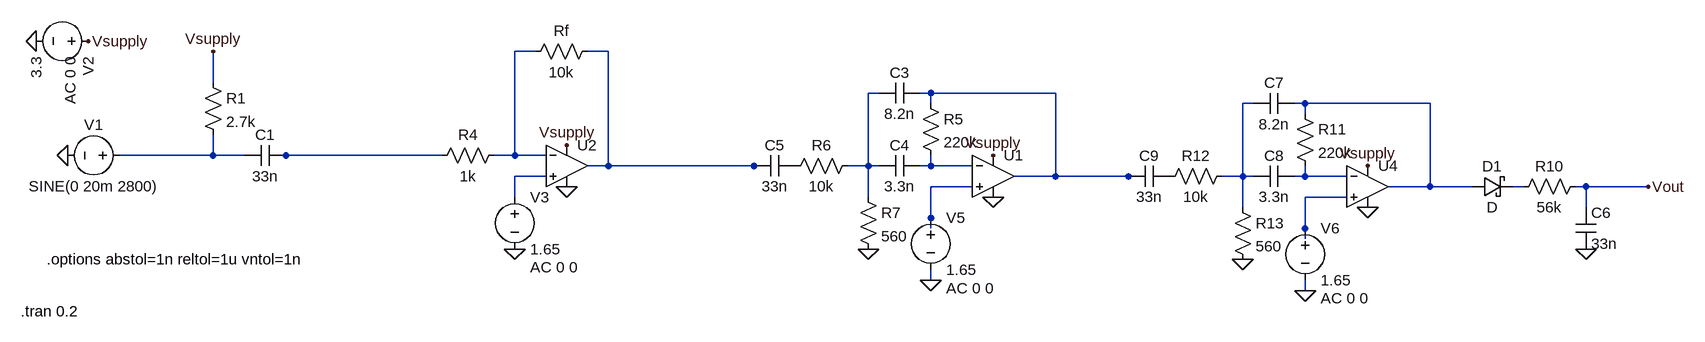
[diagram p0: schematic FullSim_connected.asc]
FullSim_connected.asc, the LTspice schematic file:
Version 4
SHEET 1 4980 740
WIRE 672 0 640 0
WIRE 784 0 752 0
WIRE 176 48 176 0
WIRE 1200 64 1184 64
WIRE 1280 64 1264 64
WIRE 1472 64 1280 64
WIRE 1280 80 1280 64
WIRE 1776 80 1760 80
WIRE 1856 80 1840 80
WIRE 2048 80 1856 80
WIRE 1856 96 1856 80
WIRE 176 160 176 128
WIRE 176 160 32 160
WIRE 224 160 176 160
WIRE 288 160 272 160
WIRE 528 160 288 160
WIRE 640 160 640 0
WIRE 640 160 608 160
WIRE 688 160 640 160
WIRE 784 176 784 0
WIRE 784 176 752 176
WIRE 1008 176 784 176
WIRE 1024 176 1008 176
WIRE 1184 176 1184 64
WIRE 1184 176 1152 176
WIRE 1200 176 1184 176
WIRE 1280 176 1280 160
WIRE 1280 176 1264 176
WIRE 1344 176 1280 176
WIRE 688 192 640 192
WIRE 1472 192 1472 64
WIRE 1472 192 1408 192
WIRE 1584 192 1472 192
WIRE 1600 192 1584 192
WIRE 1760 192 1760 80
WIRE 1760 192 1728 192
WIRE 1776 192 1760 192
WIRE 1856 192 1856 176
WIRE 1856 192 1840 192
WIRE 1920 192 1856 192
WIRE 1344 208 1280 208
WIRE 2048 208 2048 80
WIRE 2048 208 1984 208
WIRE 2112 208 2048 208
WIRE 2192 208 2176 208
WIRE 2288 208 2272 208
WIRE 2384 208 2288 208
WIRE 640 224 640 192
WIRE 1184 224 1184 176
WIRE 1920 224 1856 224
WIRE 1760 240 1760 192
WIRE 2288 240 2288 208
WIRE 1280 256 1280 208
WIRE 1280 272 1280 256
WIRE 1856 272 1856 224
WIRE 1856 288 1856 272
WIRE 1280 352 1280 336
WIRE 1856 368 1856 352
FLAG -96 -16 0
FLAG -16 -16 Vsupply
FLAG -48 160 0
FLAG 176 0 Vsupply
FLAG 720 208 0
FLAG 720 144 Vsupply
FLAG 1184 304 0
FLAG 1376 224 0
FLAG 1376 160 Vsupply
FLAG 640 304 0
FLAG 1280 352 0
FLAG 1760 320 0
FLAG 1952 240 0
FLAG 1952 176 Vsupply
FLAG 1856 368 0
FLAG 2288 304 0
FLAG 2384 208 Vout
SYMBOL voltage 48 160 R90
WINDOW 0 -32 56 VBottom 2
WINDOW 3 32 56 VTop 2
WINDOW 123 0 0 Left 0
WINDOW 39 0 0 Left 0
SYMATTR InstName V1
SYMATTR Value SINE(0 20m 2800)
SYMBOL voltage 0 -16 R90
WINDOW 123 24 44 Left 2
WINDOW 39 0 0 Left 0
SYMATTR Value2 AC 0 0
SYMATTR InstName V2
SYMATTR Value 3.3
SYMBOL cap 288 144 R90
WINDOW 0 0 32 VBottom 2
WINDOW 3 32 32 VTop 2
SYMATTR InstName C1
SYMATTR Value 33n
SYMBOL res 160 32 R0
SYMATTR InstName R1
SYMATTR Value 2.7k
SYMBOL res 624 144 R90
WINDOW 0 0 56 VBottom 2
WINDOW 3 32 56 VTop 2
SYMATTR InstName R4
SYMATTR Value 1k
SYMBOL OpAmps\\UniversalOpAmp2 720 176 R0
SYMATTR InstName U2
SYMATTR Value2 ""
SYMATTR SpiceLine Aol=100k GBW=10Meg Slew=5.5Meg Vos=0.5m
SYMATTR SpiceLine2 Rin=1Meg Rout=75
SYMBOL res 768 -16 R90
WINDOW 0 0 56 VBottom 2
WINDOW 3 32 56 VTop 2
SYMATTR InstName Rf
SYMATTR Value 10k
SYMBOL cap 1264 48 R90
WINDOW 0 0 32 VBottom 2
WINDOW 3 32 32 VTop 2
SYMATTR InstName C3
SYMATTR Value 8.2n
SYMBOL cap 1264 160 R90
WINDOW 0 0 32 VBottom 2
WINDOW 3 32 32 VTop 2
SYMATTR InstName C4
SYMATTR Value 3.3n
SYMBOL res 1264 64 R0
SYMATTR InstName R5
SYMATTR Value 220k
SYMBOL res 1168 160 R90
WINDOW 0 0 56 VBottom 2
WINDOW 3 32 56 VTop 2
SYMATTR InstName R6
SYMATTR Value 10k
SYMBOL res 1168 208 R0
SYMATTR InstName R7
SYMATTR Value 560
SYMBOL cap 1072 160 R90
WINDOW 0 0 32 VBottom 2
WINDOW 3 32 32 VTop 2
SYMATTR InstName C5
SYMATTR Value 33n
SYMBOL voltage 640 208 R0
WINDOW 123 24 124 Left 2
WINDOW 39 0 0 Left 0
SYMATTR Value2 AC 0 0
SYMATTR InstName V3
SYMATTR Value 1.65
SYMBOL voltage 1280 240 R0
WINDOW 123 24 124 Left 2
WINDOW 39 0 0 Left 0
SYMATTR Value2 AC 0 0
SYMATTR InstName V5
SYMATTR Value 1.65
SYMBOL schottky 2112 224 R270
WINDOW 0 32 32 VTop 2
WINDOW 3 0 32 VBottom 2
SYMATTR InstName D1
SYMBOL cap 2272 304 M180
WINDOW 0 24 56 Left 2
WINDOW 3 24 8 Left 2
SYMATTR InstName C6
SYMATTR Value 33n
SYMBOL res 2288 192 R90
WINDOW 0 0 56 VBottom 2
WINDOW 3 32 56 VTop 2
SYMATTR InstName R10
SYMATTR Value 56k
SYMBOL cap 1840 64 R90
WINDOW 0 0 32 VBottom 2
WINDOW 3 32 32 VTop 2
SYMATTR InstName C7
SYMATTR Value 8.2n
SYMBOL cap 1840 176 R90
WINDOW 0 0 32 VBottom 2
WINDOW 3 32 32 VTop 2
SYMATTR InstName C8
SYMATTR Value 3.3n
SYMBOL res 1840 80 R0
SYMATTR InstName R11
SYMATTR Value 220k
SYMBOL res 1744 176 R90
WINDOW 0 0 56 VBottom 2
WINDOW 3 32 56 VTop 2
SYMATTR InstName R12
SYMATTR Value 10k
SYMBOL res 1744 224 R0
SYMATTR InstName R13
SYMATTR Value 560
SYMBOL cap 1648 176 R90
WINDOW 0 0 32 VBottom 2
WINDOW 3 32 32 VTop 2
SYMATTR InstName C9
SYMATTR Value 33n
SYMBOL voltage 1856 256 R0
WINDOW 123 24 124 Left 2
WINDOW 39 0 0 Left 0
SYMATTR Value2 AC 0 0
SYMATTR InstName V6
SYMATTR Value 1.65
SYMBOL OpAmps\\UniversalOpAmp2 1376 192 R0
SYMATTR InstName U1
SYMATTR Value2 ""
SYMATTR SpiceLine Aol=100k GBW=10Meg Slew=5.5Meg Vos=0.5m
SYMATTR SpiceLine2 Rin=1Meg Rout=75
SYMBOL OpAmps\\UniversalOpAmp2 1952 208 R0
SYMATTR InstName U4
SYMATTR Value2 ""
SYMATTR SpiceLine Aol=100k GBW=10Meg Slew=5.5Meg Vos=0.5m
SYMATTR SpiceLine2 Rin=1Meg Rout=75
TEXT -80 320 Left 2 !.options abstol=1n reltol=1u vntol=1n
TEXT -120 400 Left 2 !.tran 0.2

The netlist it stands for:
* FullSim_connected.asc
V1 N007 0 SINE(0 20m 2800)
V2 Vsupply 0 3.3 AC 0 0
C1 N008 N007 33n
R1 Vsupply N007 2.7k
R4 N001 N008 1k
XU2 N010 N001 Vsupply 0 N002 level2 Aol=100k GBW=10Meg Slew=5.5Meg Vos=0.5m Rin=1Meg Rout=75  ; pins In+ In- V+ V- OUT
Rf N002 N001 10k
C3 N004 N003 8.2n
C4 N009 N003 3.3n
R5 N004 N009 220k
R6 N003 P001 10k
R7 N003 0 560
C5 P001 N002 33n
V3 N010 0 1.65 AC 0 0
V5 N012 0 1.65 AC 0 0
D1 N006 N013 D
C6 0 Vout 33n
R10 Vout N013 56k
C7 N006 N005 8.2n
C8 N011 N005 3.3n
R11 N006 N011 220k
R12 N005 P002 10k
R13 N005 0 560
C9 P002 N004 33n
V6 N014 0 1.65 AC 0 0
XU1 N012 N009 Vsupply 0 N004 level2 Aol=100k GBW=10Meg Slew=5.5Meg Vos=0.5m Rin=1Meg Rout=75  ; pins In+ In- V+ V- OUT
XU4 N014 N011 Vsupply 0 N006 level2 Aol=100k GBW=10Meg Slew=5.5Meg Vos=0.5m Rin=1Meg Rout=75  ; pins In+ In- V+ V- OUT
.model D D
.lib standard.dio
.options abstol=1n reltol=1u vntol=1n
.tran 0.2
.lib UniversalOpAmp2.lib
.backanno
.end